# EAGLE design subd (EAGLE 7.6.0)
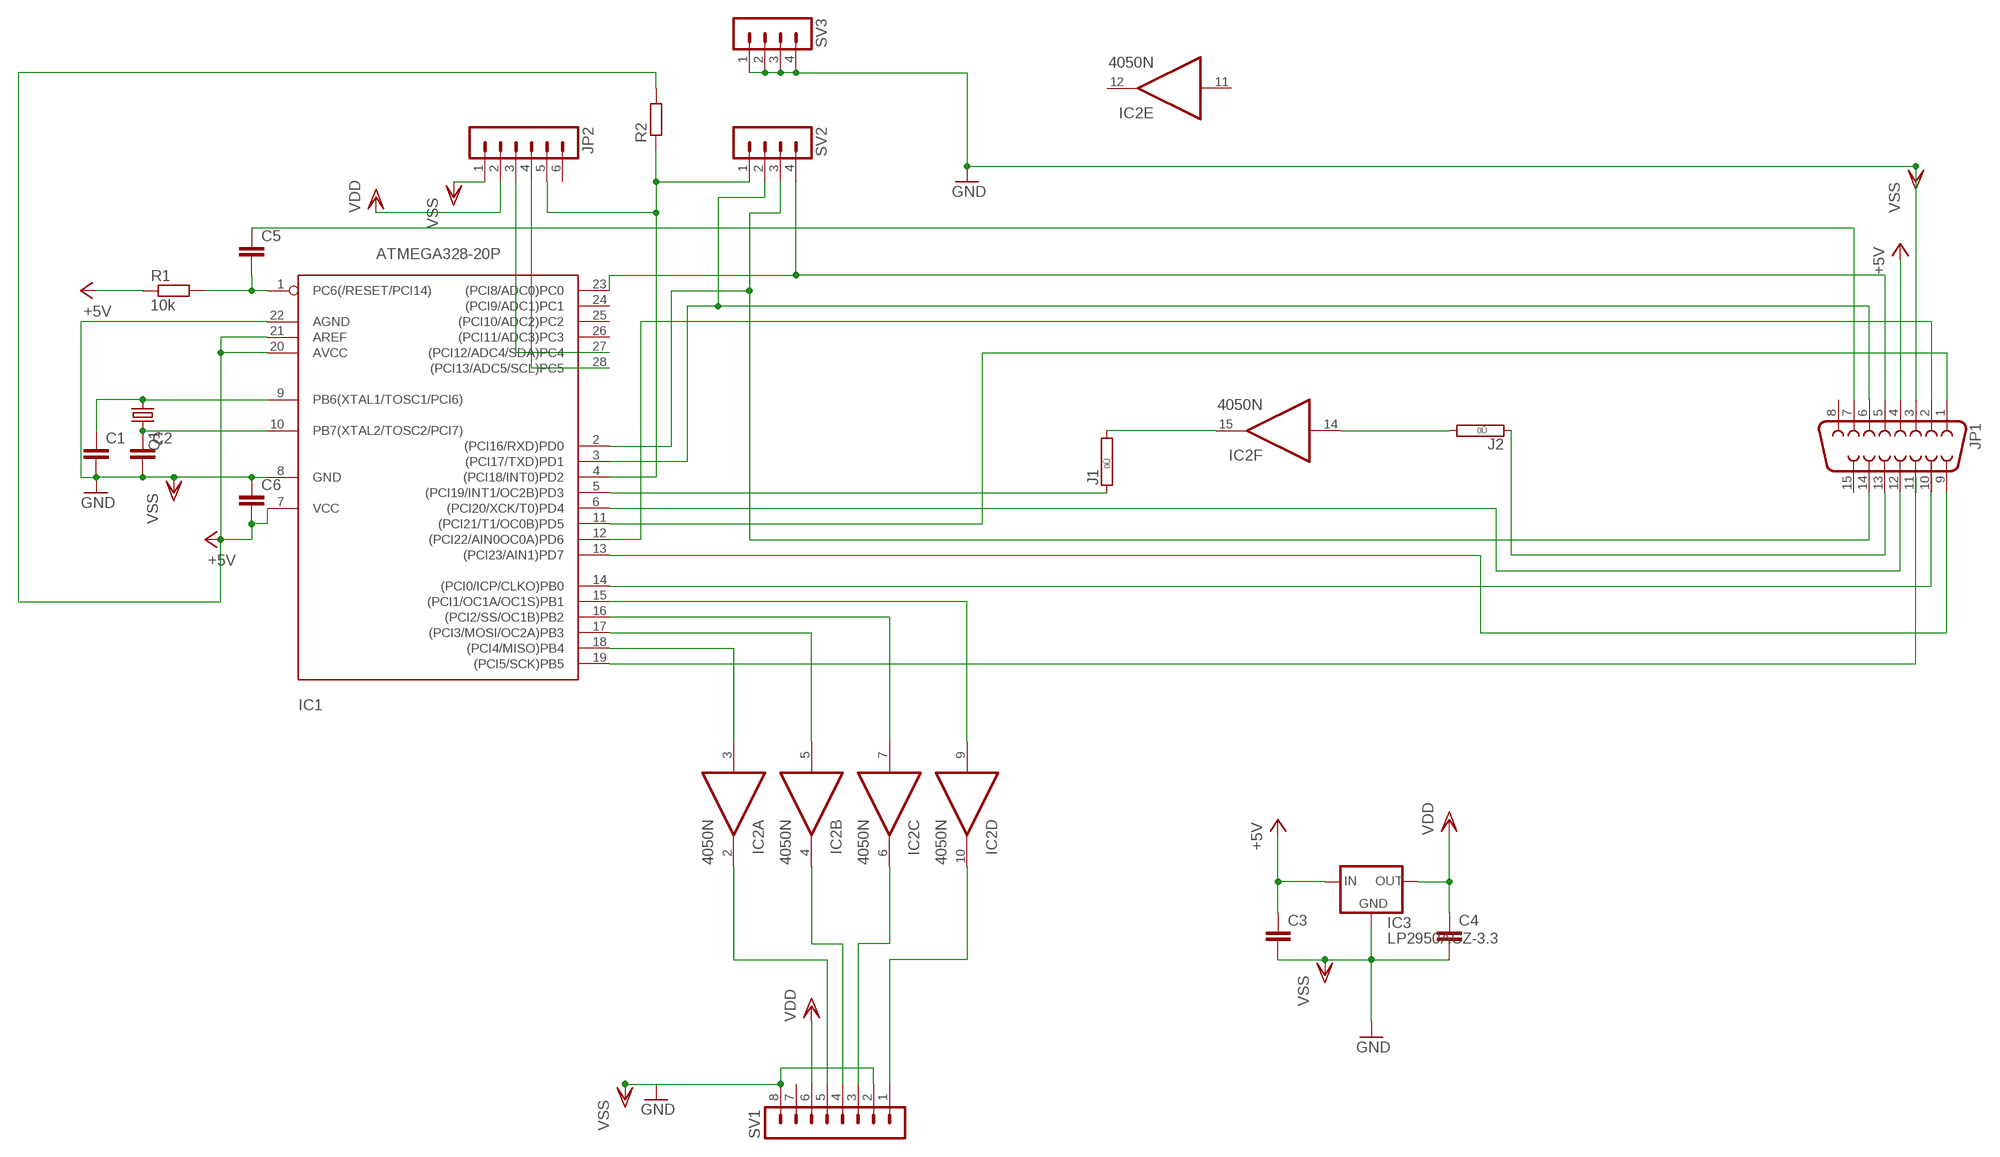
[diagram p0: schematic, sheet 1]

## Parts
C1  C5/3  [C5B3]
C2  C5/3  [C5B3]
C3  C2.5/5  [C2.5-5]
C4  C2.5/5  [C2.5-5]
C5  C5/3  [C5B3]
C6  C5/3  [C5B3]
IC1  ATMEGA328-20P  [DIL28-3]
IC2  4050N  [DIL16]
IC3  LP2950ACZ-3.3  [TO92]
J1  0R  [0R/10]
J2  0R  [0R/10]
JP1  F15H  [F15H]
JP2  MA06-1  [MA06-1]
Q1  CRYSTALHC18U-V  [HC18U-V]
R1  10k  R-EU_0207/12  [0207/12]
R2  R-EU_0207/10  [0207/10]
SV1  MA08-1  [MA08-1]
SV2  MA04-1  [MA04-1]
SV3  MA04-1  [MA04-1]

## Nets
+5V: C3.1 C6.2 IC1.7(VCC) IC1.20(AVCC) IC1.21(AREF) IC3.3(IN) JP1.4 R1.1 R2.2
N$1: C1.1 IC1.9(PB6(XTAL1/TOSC1/PCI6)) Q1.1
N$2: C2.1 IC1.10(PB7(XTAL2/TOSC2/PCI7)) Q1.2
N$3: IC1.14((PCI0/ICP/CLKO)PB0) JP1.10
N$4: IC1.13((PCI23/AIN1)PD7) JP1.9
N$5: IC1.15((PCI1/OC1A/OC1S)PB1) IC2.9(D:I)
N$6: IC1.16((PCI2/SS/OC1B)PB2) IC2.7(C:I)
N$7: IC1.17((PCI3/MOSI/OC2A)PB3) IC2.5(B:I)
N$8: IC1.18((PCI4/MISO)PB4) IC2.3(A:I)
N$9: IC2.2(A:O) SV1.5
N$10: IC2.4(B:O) SV1.4
N$11: IC2.6(C:O) SV1.3
N$12: IC2.10(D:O) SV1.1
N$13: IC1.12((PCI22/AIN0OC0A)PD6) JP1.2
N$14: IC1.11((PCI21/T1/OC0B)PD5) JP1.1
N$15: IC1.6((PCI20/XCK/T0)PD4) JP1.12
N$16: IC1.5((PCI19/INT1/OC2B)PD3) J1.1
N$17: C5.1 JP1.7
N$18: C5.2 IC1.1(PC6(/RESET/PCI14)) R1.2
N$19: IC1.27((PCI12/ADC4/SDA)PC4) JP2.3
N$20: IC1.28((PCI13/ADC5/SCL)PC5) JP2.4
N$21: IC1.4((PCI18/INT0)PD2) JP2.5 R2.1 SV2.1
N$23: IC1.3((PCI17/TXD)PD1) JP1.6 SV2.2
N$24: IC1.2((PCI16/RXD)PD0) JP1.14 SV2.3
N$25: IC2.14(F:I) J2.2
N$26: IC1.23((PCI8/ADC0)PC0) JP1.5 SV2.4
N$27: IC2.15(F:O) J1.2
N$28: J2.1 JP1.13
N$29: IC1.19((PCI5/SCK)PB5) JP1.11
VDD: C4.1 IC3.1(OUT) JP2.2 SV1.6
VSS: C1.2 C2.2 C3.2 C4.2 C6.1 IC1.8(GND) IC1.22(AGND) IC3.2(GND) JP1.3 JP2.1 SV1.2 SV1.8 SV3.1 SV3.2 SV3.3 SV3.4 ; supply symbol labelled GND
Unconnected: IC1.24((PCI9/ADC1)PC1) IC1.25((PCI10/ADC2)PC2) IC1.26((PCI11/ADC3)PC3) IC2.11(E:I) IC2.12(E:O) JP1.8 JP1.15 JP2.6 SV1.7

## Power pins joined to a net without a drawn wire
VDD: IC2.1(P:VDD)
VSS: IC2.8(P:VSS)

## Library data of the parts
C1-C6 = capacitor-wima:C: CAPACITOR naming: grid - package width
IC1 = atmega328:ATMEGA328*P: MICROCONTROLLER 32 kBytes FLASH 2 kBytes SRAM 1 kBytes EEPROM USART 8-channel 10 bit ADC
IC2 = 40xx:4050: Hex non-inverting BUFFER
IC3 = v-reg:LP2950?*: Source: http://cache.national.com/ds/LP/LP2950.pdf
J1 J2 = jumper:0R: Bridge 0R 10mm
JP1 = con-subd:F15: SUB-D; OC_FARNELL: unknown; OC_NEWARK: unknown
JP2 = con-lstb:MA06-1: PIN HEADER; OC_FARNELL: unknown; OC_NEWARK: unknown
Q1 = crystal:CRYSTAL: CRYSTAL; OC_FARNELL: unknown; OC_NEWARK: unknown
R1 R2 = resistor:R-EU_: RESISTOR, European symbol
SV1 = con-lstb:MA08-1: PIN HEADER; OC_FARNELL: unknown; OC_NEWARK: unknown
SV2 SV3 = con-lstb:MA04-1: PIN HEADER; OC_FARNELL: unknown; OC_NEWARK: unknown

## Net classes
0 default: clearance 0.205 mm

## Board
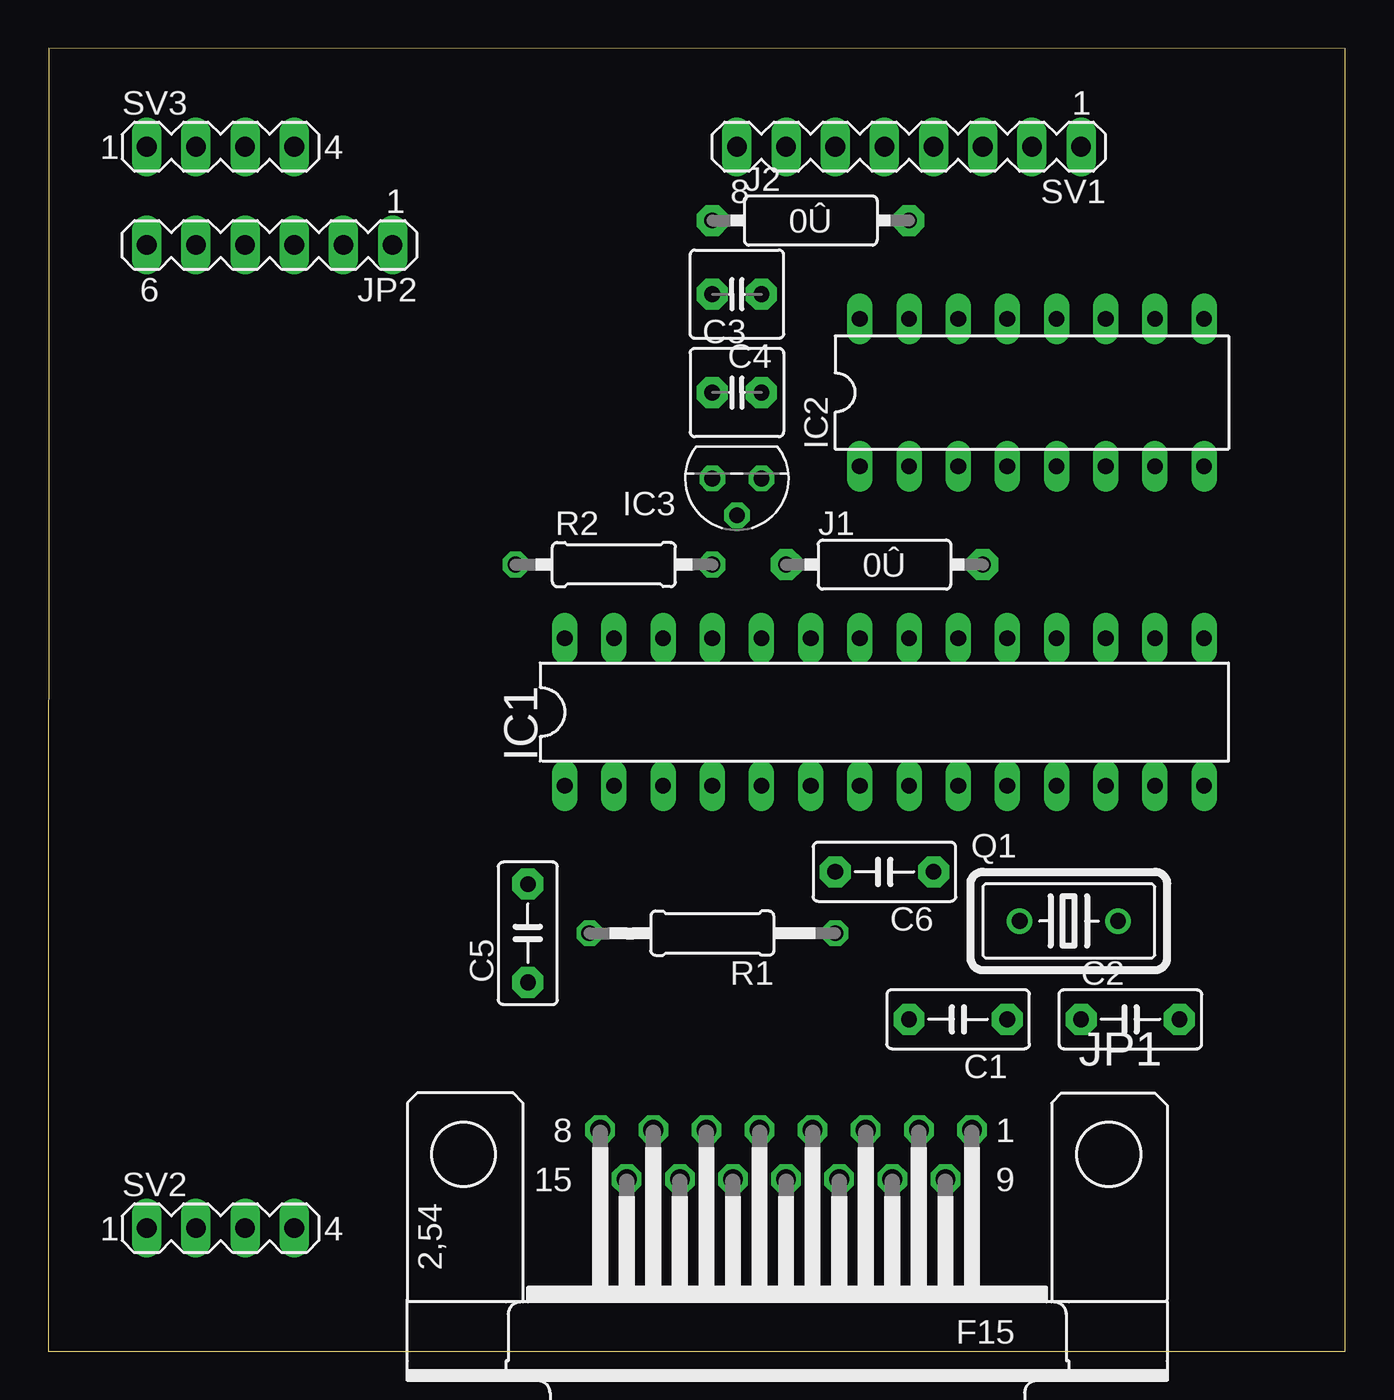
[diagram p1: board, top side]
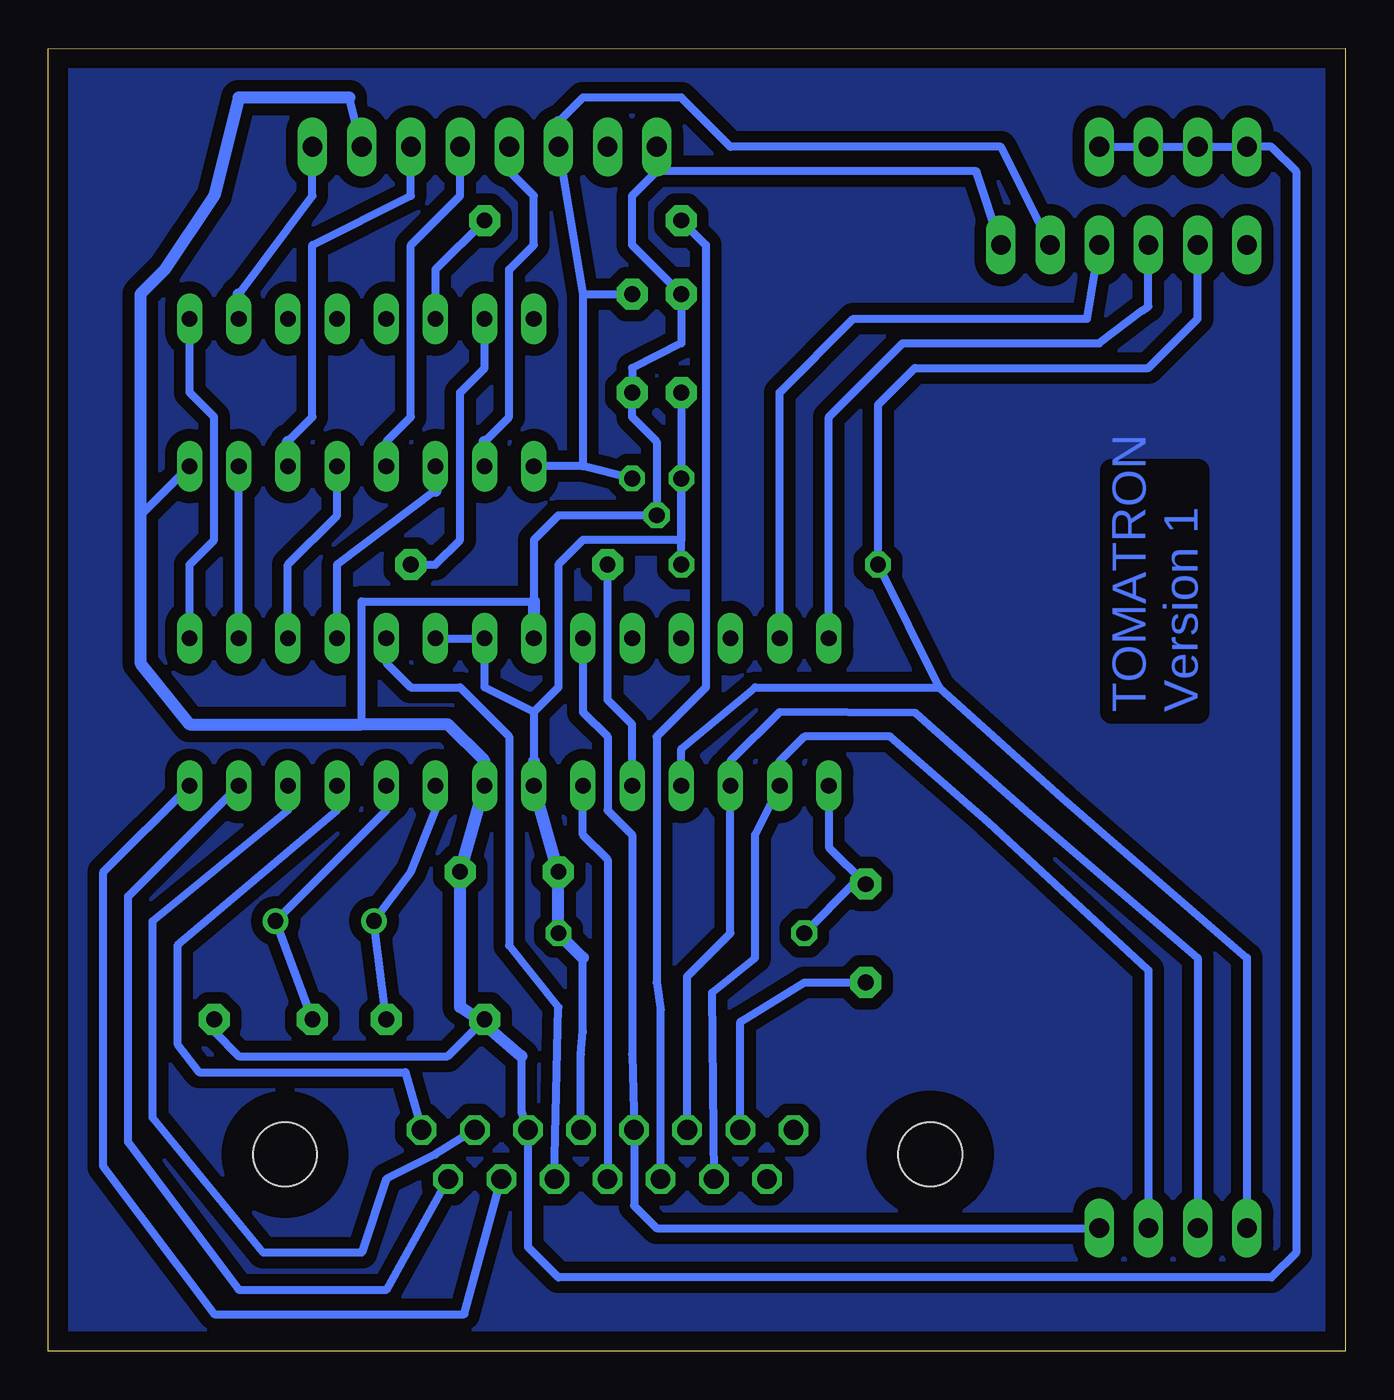
[diagram p2: board, bottom side, seen from below]

Size 66.98 x 67.31 mm. Coordinates in mm from the lower left corner, seen from the top.
Outline: 0,0 66.98,0 66.98,67.3 0.01,67.31 0,0
Copper layers (1*16): Top 0.035mm / dielectric 1.5mm / Bottom 0.035mm
Design rules "default": minimum track width 10mil, minimum drill 24mil, track to track 8mil, track to pad 8mil, pad to pad 8mil, via to via 8mil, smd to smd 8mil, copper to edge 40mil, drill to drill 8mil, minimum pad ring 10mil, minimum via ring 8mil, stop-mask expansion 4mil, vias tented up to drill 0mil, thermal gap 10mil

### Footprints (pad centres in the part's own frame; a part is rotated, then mirrored left to right if it is on the bottom)
C5B3 = drill 0.813 pad 1.6 octagon: 1 -2.54,0; 2 2.54,0
C2.5-5 = drill 0.813 pad 1.6 octagon: 1 -1.27,0; 2 1.27,0
DIL28-3 = drill 0.813 long: 1 -16.51,-3.81; 2 -13.97,-3.81; 3 -11.43,-3.81; 4 -8.89,-3.81; 5 -6.35,-3.81; 6 -3.81,-3.81; 7 -1.27,-3.81; 8 1.27,-3.81; 9 3.81,-3.81; 10 6.35,-3.81; 11 8.89,-3.81; 12 11.43,-3.81; 13 13.97,-3.81; 14 16.51,-3.81; 15 16.51,3.81; 16 13.97,3.81; 17 11.43,3.81; 18 8.89,3.81; 19 6.35,3.81; 20 3.81,3.81; 21 1.27,3.81; 22 -1.27,3.81; 23 -3.81,3.81; 24 -6.35,3.81; 25 -8.89,3.81; 26 -11.43,3.81; 27 -13.97,3.81; 28 -16.51,3.81
DIL16 = drill 0.813 long: 1 -8.89,-3.81; 2 -6.35,-3.81; 3 -3.81,-3.81; 4 -1.27,-3.81; 5 1.27,-3.81; 6 3.81,-3.81; 7 6.35,-3.81; 8 8.89,-3.81; 9 8.89,3.81; 10 6.35,3.81; 11 3.81,3.81; 12 1.27,3.81; 13 -1.27,3.81; 14 -3.81,3.81; 15 -6.35,3.81; 16 -8.89,3.81
TO92 = drill 0.813 octagon: 1 -1.27,0; 2 0,1.905; 3 1.27,0
0R/10 = drill 0.813 pad 1.6 octagon: 1 -5.08,0; 2 5.08,0
F15H = drill 1.016 octagon: 1 -9.601,-1.27; 2 -6.858,-1.27; 3 -4.115,-1.27; 4 -1.372,-1.27; 5 1.372,-1.27; 6 4.115,-1.27; 7 6.858,-1.27; 8 9.601,-1.27; 9 -8.23,1.27; 10 -5.486,1.27; 11 -2.743,1.27; 12 0,1.27; 13 2.743,1.27; 14 5.486,1.27; 15 8.23,1.27 | hole 3.302: -16.662,0; 16.662,0
MA06-1 = drill 1.016 long: 1 -6.35,0; 2 -3.81,0; 3 -1.27,0; 4 1.27,0; 5 3.81,0; 6 6.35,0
HC18U-V = drill 0.813: 1 -2.54,0; 2 2.54,0
0207/12 = drill 0.813 octagon: 1 -6.35,0; 2 6.35,0
0207/10 = drill 0.813 octagon: 1 -5.08,0; 2 5.08,0
MA08-1 = drill 1.016 long: 1 -8.89,0; 2 -6.35,0; 3 -3.81,0; 4 -1.27,0; 5 1.27,0; 6 3.81,0; 7 6.35,0; 8 8.89,0
MA04-1 = drill 1.016 long: 1 -3.81,0; 2 -1.27,0; 3 1.27,0; 4 3.81,0

### Placement (x,y rotation side)
C1  46.99,17.14 180 top
C2  55.88,17.14 0 top
C3  35.56,49.53 0 top
C4  35.56,54.61 180 top
C5  24.77,21.59 90 top
C6  43.18,24.77 180 top
IC1  43.18,33.02 0 top
IC2  50.8,49.53 0 top
IC3  35.56,45.09 180 top
J1  43.18,40.64 0 top
J2  39.37,58.42 0 top
JP1  38.1,10.16 180 top
JP2  11.43,57.15 180 top
Q1  52.7,22.23 0 top
R1  34.29,21.59 180 top
R2  29.21,40.64 0 top
SV1  44.45,62.23 180 top
SV2  8.89,6.35 0 top
SV3  8.89,62.23 0 top

### Tracks (layer width: path | path; a pad name or v marks a point on that pad's centre or on a via)
+5V
  Bottom 0.406: IC1.20 IC1.21 44.45,34.29 41.91,33.02 | C3.1 IC3.3 | IC3.3 34.29,41.91 39.37,41.91 40.64,40.64 40.64,34.29 41.91,33.02 | 41.91,33.02 41.91,30.48 | R2.2 IC3.3 | JP1.4 39.47,15.34 39.37,16.51 39.37,20.32
  Bottom 0.61: 41.91,30.48 IC1.7 C6.2 R1.1 39.37,20.32
N$1
  Bottom 0.406: C1.1 Q1.1 48.26,24.77 46.99,27.94 IC1.9
N$2
  Bottom 0.406: C2.1 Q1.2 49.53,27.94 IC1.10
N$3
  Bottom 0.406: IC1.14 64.14,24.77 64.14,9.53 58.42,1.91 45.49,1.91 JP1.10
N$4
  Bottom 0.406: IC1.13 62.87,23.5 62.87,10.79 57.15,3.17 49.51,3.17 JP1.9
N$5
  Bottom 0.406: IC1.15 59.69,40.64 58.42,41.91 58.42,48.26 59.69,49.53 IC2.9
N$6
  Bottom 0.406: IC1.16 IC2.7
N$7
  Bottom 0.406: IC1.17 54.61,40.64 52.07,43.18 IC2.5
N$8
  Bottom 0.406: IC1.18 52.07,40.64 46.99,44.45
  Bottom 0.61: 46.99,44.45 IC2.3
N$9
  Bottom 0.406: 44.45,46.99 43.18,48.26 43.18,55.88 41.91,57.15 41.91,59.69 43.18,60.96 SV1.5
  Bottom 0.61: IC2.2 44.45,46.99
N$10
  Bottom 0.406: IC2.4 49.53,46.99 48.26,48.26 48.26,57.15 45.72,59.69 SV1.4
N$11
  Bottom 0.406: SV1.3 48.26,59.69 53.34,57.15 53.34,48.26 54.61,46.99
  Bottom 0.61: IC2.6 54.61,46.99
N$12
  Bottom 0.406: 57.15,54.61 53.34,59.69 SV1.1
  Bottom 0.61: IC2.10 57.15,54.61
N$13
  Bottom 0.406: IC1.12 54.61,27.94 61.59,22.23 61.59,12.06 55.88,5.08 50.8,5.08 49.53,8.89 46.99,10.16 JP1.2
N$14
  Bottom 0.406: IC1.11 52.07,27.94 60.33,20.95 60.33,15.88 59.2,14.4 48.54,14.4 JP1.1
N$15
  Bottom 0.406: IC1.6 39.37,26.67 38.1,25.4 JP1.12
N$16
  Bottom 0.406: IC1.5 36.83,32.38 38.1,33.66 J1.1
N$17
  Bottom 0.406: JP1.7 31.24,17.02 27.94,19.05 C5.1
N$18
  Bottom 0.406: IC1.1 26.67,26.04 C5.2 25.4,24.13 R1.2
N$19
  Bottom 0.406: JP2.3 13.34,53.34 25.4,53.34 29.21,49.53 IC1.27
N$20
  Bottom 0.406: JP2.4 10.16,53.98 10.45,53.78 12.7,52.07 22.86,52.07 26.67,48.26 IC1.28
N$21
  Bottom 0.406: IC1.4 34.29,31.11 30.48,34.29 20.95,34.29 | 20.95,34.29 14.61,28.57 5.08,20.32 SV2.1 | 20.95,34.29 R2.1 24.13,48.9 22.23,50.8 10.16,50.8 7.62,53.34 JP2.5
N$22
  pour Bottom (isolate 0.61, no thermals): 0,67.31 67.31,67.31 67.31,0 0,0
N$23
  Bottom 0.406: SV2.2 7.62,20.32 16.51,27.94 22.17,32.97 29.21,33.02 31.75,30.48 IC1.3 31.75,21.59 33.98,19.36 JP1.6
N$24
  Bottom 0.406: SV2.3 10.16,19.68 18.41,27.3 23.5,31.75 27.94,31.75 29.21,30.48 IC1.2 30.48,26.67 30.48,20.32 32.72,18.52 JP1.14
N$25
  Bottom 0.406: J2.2 46.99,55.88 IC2.14
N$26
  Bottom 0.406: IC1.23 39.37,33.02 38.1,31.75 38.1,27.94 36.83,26.67 36.83,15.34 JP1.5 36.73,7.52 35.56,6.35 SV2.4
N$27
  Bottom 0.406: J1.2 46.99,40.64 45.72,41.91 45.72,49.53 44.45,50.8 IC2.15
N$28
  Bottom 0.406: J2.1 33.02,57.15 33.02,34.29 35.56,31.75 35.56,19.05 35.36,17.58 JP1.13
N$29
  Bottom 0.406: IC1.19 49.53,35.56 48.26,34.29 45.72,34.29 43.18,31.75 43.18,20.95 40.64,17.78 JP1.11
VDD
  Bottom 0.406: IC3.1 39.37,45.72 | SV1.6 39.37,54.61 | 39.37,54.61 C4.1 | 39.37,54.61 39.37,45.72 | 39.37,45.72 IC2.1 | 40.64,63.5 39.37,64.77 34.29,64.77 31.75,62.23 17.78,62.23 JP2.2
  Bottom 0.61: 40.64,63.5 SV1.6
VSS
  Bottom 0.406: IC2.8 62.23,43.18 | 50.8,32.38 50.8,38.73 41.91,38.73 41.91,41.91 40.64,43.18 IC3.2 35.56,46.99 36.83,48.26 C3.2 36.83,50.8 34.29,52.07 C4.2 36.83,57.15 36.83,59.69 35.56,60.96 | SV1.2 51.44,64.77 | 35.56,60.96 SV1.8 | JP2.1 19.05,60.96 35.56,60.96 | 42.55,15.24 42.55,12.39 JP1.3 42.22,5.38 40.64,3.81 3.81,3.81 2.54,5.08 2.54,60.96 3.81,62.23 SV3.1 SV3.2 SV3.3 SV3.4 | C2.2 58.42,16.51 57.15,15.24 46.35,15.24 C1.2 44.79,17.14 44.84,17.19
  Bottom 0.61: 41.91,38.73 IC1.22 | 42.55,15.24 44.84,17.19 45.72,17.78 C6.1 IC1.8 44.45,30.48 46.35,32.38 50.8,32.38 59.69,32.38 62.23,35.56 62.23,43.18 62.23,54.61 60.96,55.88 58.42,59.69 57.15,64.77 51.44,64.77

### Text on the board
Bottom: TOMATRON / Version 1